# Altium schematic sheet 2_5VSwithcingRegulator.SchDoc
size A4; PageSetup: Record=PageOptions|CenterHorizontal=True|CenterVertical=True|PrintScale=1.00|XCorrection=1.00|YCorrection=1.00|PrintKind=1|BorderSize=5000000|LeftOffset=0|BottomOffset=0|Orientation=2|PaperLength=1000|PaperWidth=1000|Scale=100|PaperSource=7|PrintQuality=-3|MediaType=1|DitherType=10|PrintScaleMode=1|PaperKind=Executive|PaperIndex=7
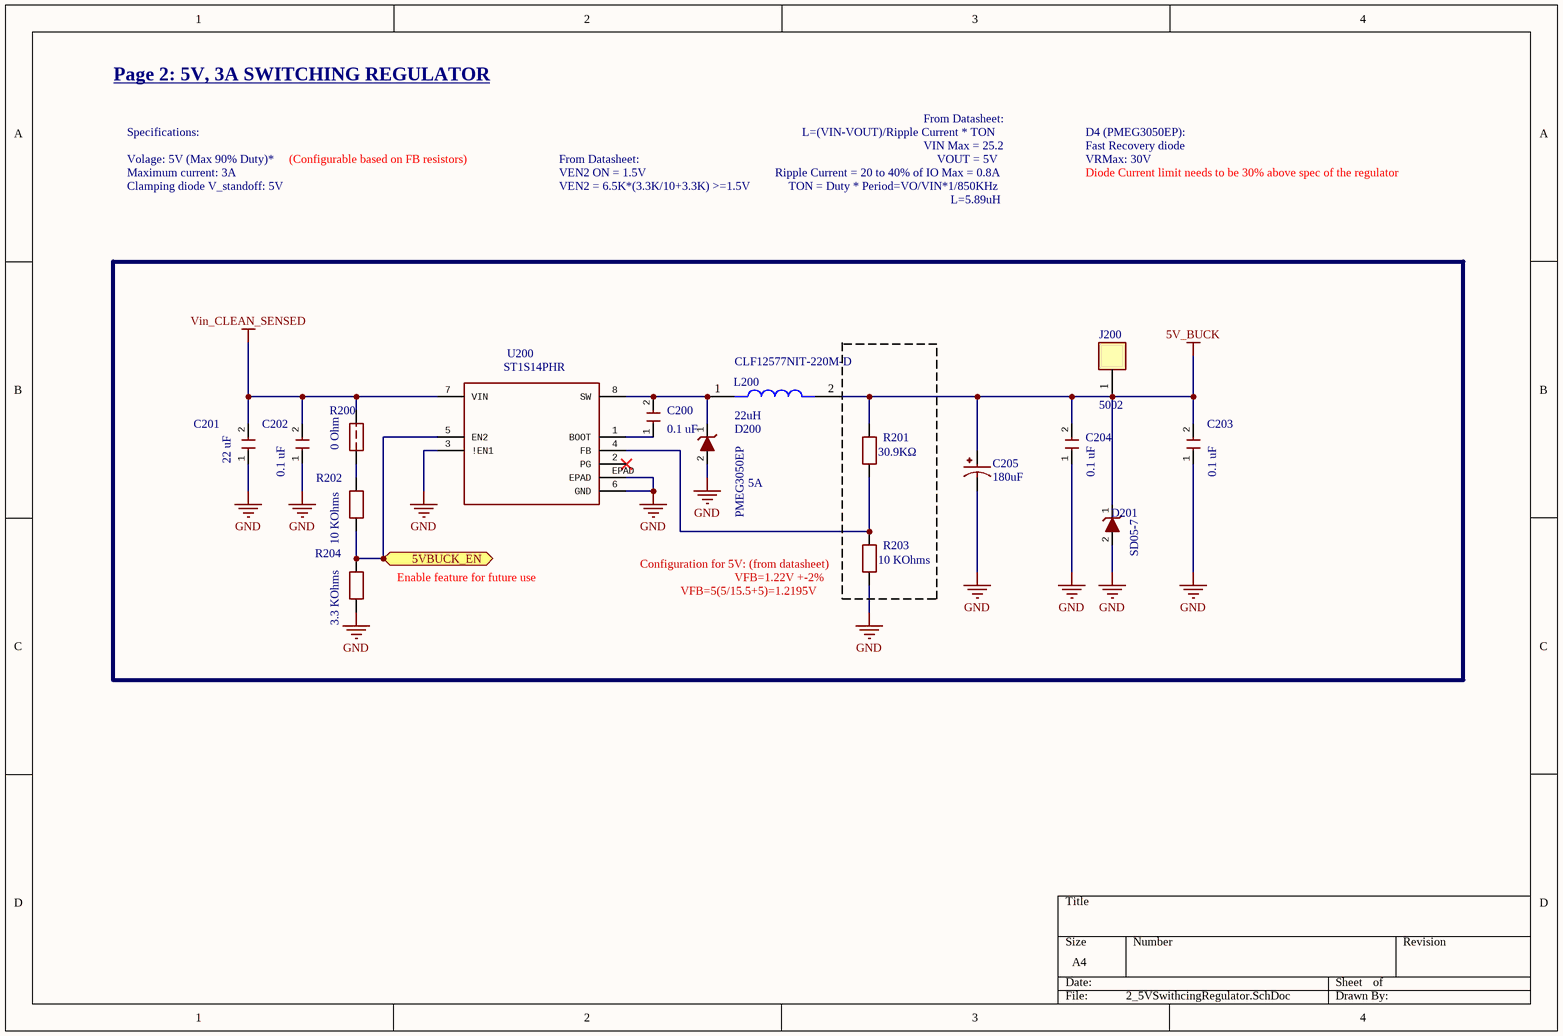
[diagram p0: 2_5VSwithcingRegulator.SchDoc]

## Parts
C200  value 0.1 uF  [CAP_0603]  (hidden comment: CL10B104KB8NNNC)
C201  value 22 uF  [CAP_0603]  (hidden comment: GRM188R61A226ME15D)
C202  value 0.1 uF  [CAP_0603]  (hidden comment: CL10B104KB8NNNC)
C203  value 0.1 uF  [CAP_0603]  (hidden comment: CL10B104KB8NNNC)
C204  value 0.1 uF  [CAP_0603]  (hidden comment: CL10B104KB8NNNC)
C205  value 180uF  [CAP_EEEFKE181XSP]  (hidden comment: EEE-FKE181XSP)
D200  PMEG3050EP  [DIODE_SOD-128]
D201  SD05-7  [DIODE_DO-214AC]
J200  5002  [KEYSTONE_5002]
L200  CLF12577NIT-220M-D  value 22uH  [IND_TDK_CLF12577NIT]
R200  value 0 Ohm  [RES_0603]  (hidden comment: ERJ3GEY0R00V)
R201  value 30.9KΩ  [RES_0603]  (hidden comment: CRCW060330K9FKEA)
R202  value 10 KOhms  [RES_0603]  (hidden comment: ERJ3GEYJ103V)
R203  value 10 KOhms  [RES_0603]  (hidden comment: ERJ3GEYJ103V)
R204  value 3.3 KOhms  [RES_0603]  (hidden comment: P3.3KGDKR-ND)
U200  ST1S14PHR  [REG_SOP8_SOIC8_EPAD]

## Ports
5VBUCK_EN (in)

## Nets
5V_BUCK: C203.2 C204.2 C205.1 D201.1 J200.1 L200.2 R201.2
GND: C201.1 C202.1 C203.1 C204.1 C205.2 D200.2 D201.2 R203.1 R204.1 U200.3(!EN1) U200.6(GND) U200.EPAD
Vin_CLEAN_SENSED: C201.2 C202.2 R200.2 U200.7(VIN)
5VBUCK_EN: R202.1 R204.2 U200.5(EN2) ; port 5VBUCK_EN
NetC200_1: C200.1 U200.1(BOOT)
NetC200_2: C200.2 D200.1 L200.1 U200.8(SW)
NetR200_1: R200.1 R202.2
NetR201_1: R201.1 R203.2 U200.4(FB)

Not connected (* = marked no-connect by the designer): U200 2(PG)*

## Notes on the sheet
- Page 2: 5V, 3A SWITCHING REGULATOR
- Volage: 5V (Max 90% Duty)*
- Maximum current: 3A
- Specifications:
- (Configurable based on FB resistors)
- From Datasheet:
- VEN2 ON = 1.5V
- Ripple Current = 20 to 40% of IO Max = 0.8A
- L=(VIN-VOUT)/Ripple Current * TON
- VIN Max = 25.2
- VOUT = 5V
- Fast Recovery diode
- VRMax: 30V
- D4 (PMEG3050EP):
- Diode Current limit needs to be 30% above spec of the regulator
- Clamping diode V_standoff: 5V
- VEN2 = 6.5K*(3.3K/10+3.3K) >=1.5V
- TON = Duty * Period=VO/VIN*1/850KHz
- L=5.89uH
- (near D200) 5A
- (near R204) Enable feature for future use
- (near R203) Configuration for 5V: (from datasheet)
- (near R203) VFB=1.22V +-2%
- (near R203) VFB=5(5/15.5+5)=1.2195V

## Library data of the parts
C200 C202-C204 = CL10B104KB8NNNC: Cap Ceramic 0.1uF 50V 0603; Manufacturer_Name: Samsung; Link: https://www.digikey.ca/en/products/detail/samsung-electro-mechanics/CL10B104KB8NNNC/3886658?s=N4IgTCBcDaIMIBkCMAGAQqgLAaTQDgDki4QBdAXyA; Package: 0603; PartNumber: CL10B104KB8NNNC; SupplierPartNumber: 1276-1000-2-ND; SuppliersPartNumber: C1591
C201 = GRM188R61A226ME15D: Cap Ceramic 22uF 10V 0603; Manufacturer_Name: Samsung Electro-Mechanics; Link: https://www.digikey.ca/en/products/detail/murata-electronics/GRM188R61A226ME15D/5027561?s=N4IgTCBcDaIOICUCyBGAHGhA2FBBMYWSAoigKwAiIAugL5A; Package: 0603; PartNumber: GRM188R61A226ME15D; SupplierNumber: 490-10476-2-ND; SuppliersPartNumber: C84419
C205 = EEEFKE181XSP: Cap Electrolytic 180uF SMD,D6.3xL7.7mm; Manufacturer: Panasonic; Package: SMD,D6.3xL7.7mm; PartNumber: EEE-FKE181XSP; SupplierNumber: P18956TR-ND; SuppliersPartNumber: C413657; Link: https://www.digikey.ca/en/products/detail/panasonic-electronic-components/EEE-FKE181XSP/5805038?s=N4IgTCBcDaIKIIGIGk4EYAcaAaBlACiALoC%2BQA
D200 = PMEG3050EP: Diode FastRecovery 30V SOD-128; Mfr_Name: Nexperia; Value: FastRecovery 30V; Link: https://www.digikey.ca/en/products/detail/nexperia-usa-inc/PMEG3050EP-115/2228695; Package: SOD-128; PartNumber: PMEG3050EP; SupplierPartNumber: 1727-5317-2-ND; SuppliersPartNumber: C134975
D201 = SD05-7: Diode TVS 5V; Mfr_Name: Diodes Inc; Value: TVS 5V; Link: https://www.digikey.ca/en/products/detail/diodes-incorporated/SD05-7/2052792; Package: SOD-323; PartNumber: SD05-7; SupplierPartNumber: SD05DITR-ND; SuppliersPartNumber: C460454
J200 = 5002: Test Point Ring Keystone; Manufacturer: Keystone Electronics; Value: Test Point Keystone Electronics; Package: *; PartNumber: 5002; SupplierNumber: 36-5002-ND; SuppliersPartNumber: C238123; Link: https://www.digikey.ca/en/products/detail/keystone-electronics/5002/255328
L200 = CLF12577NIT-220M-D: Ind 22uH Shielded Drum Core 4.5A; Manufacturer: TDK; PartNumber: CLF12577NIT-220M-D; Package: NON STANDARD-2 TDK; Link: https://www.digikey.ca/en/products/detail/tdk-corporation/CLF12577NIT-220M-D/6236873?s=N4IgTCBcDaIMIBkBiBGMBWA7JgcgSQBUBaMMABgFkiAREAXQF8g; SupplierPartNumber: 445-174735-2-ND; SuppliersPartNumber: C138319
R200 = ERJ3GEY0R00V: Res 0Ohm 1/10W 0603; Link: https://www.digikey.ca/en/products/detail/panasonic-electronic-components/ERJ-3GEY0R00V/135656?s=N4IgTCBcDaIKICUBSBmA4nAmgBgd7AaiALoC%2BQA; Package: 0603; SupplierPartNumber: P0.0GTR-ND; SuppliersPartNumber: C122704; PartNumber: ERJ3GEY0R00V
R201 = CRCW060330K9FKEA: Res 30.9KOhm 1/10W 0603; Manufacturer_Name: Vishay Intertech; Link: https://www.digikey.ca/en/products/detail/vishay-dale/CRCW060330K9FKEAHP/2222269; Package: 0603; SupplierPartNumber: 541-30.9KSTR-ND; SuppliersPartNumber: C844354; PartNumber: CRCW060330K9FKEA
R202 R203 = ERJ3GEYJ103V: Res 10KOhms 1/10W 0603; Link: https://www.mouser.ca/ProductDetail/Panasonic/ERJ-3GEYJ103V?qs=66DK8nO8gJBWgc%252B0VNNxzg%3D%3D; Package: 0603; PartNumber: ERJ3GEYJ103V; SupplierPartNumber: 667-ERJ-3GEYJ103V; SuppliersPartNumber: C169849
R204 = P3.3KGDKR-ND: Res 3.3KOhms 1/10W 0603; PartNumber: ERJ-3GEYJ332V; SymbolName_1: RES; Link: https://www.digikey.ca/en/products/detail/panasonic-electronic-components/ERJ-3GEYJ332V/135886?s=N4IgTCBcDaIKICUBSBaAzAcTgTSWtYAaiALoC%2BQA; Package: 0603; SupplierNumber: P3.3KGDKR-ND; SuppliersPartNumber: C403480
U200 = ST1S14PHR: Switching Step-down In5.5V~48V Out3A; Mfr_Name: STMicroelectronics; DeviceSetName: ST1S14PHR; Manufacturer_Part_Number: ST1S14PHR; Value: Switching Step-down; Link: https://www.digikey.ca/en/products/detail/stmicroelectronics/ST1S14PHR/2469146?s=N4IgTCBcDaIMoBUCMckBYAKAJASiAugL5A; Package: HSOP-8; PartNumber: ST1S14PHR; SupplierPartNumber: 497-10816-2-ND; SuppliersPartNumber: C84130